# Altium schematic sheet Charge Amp.SchDoc
size A
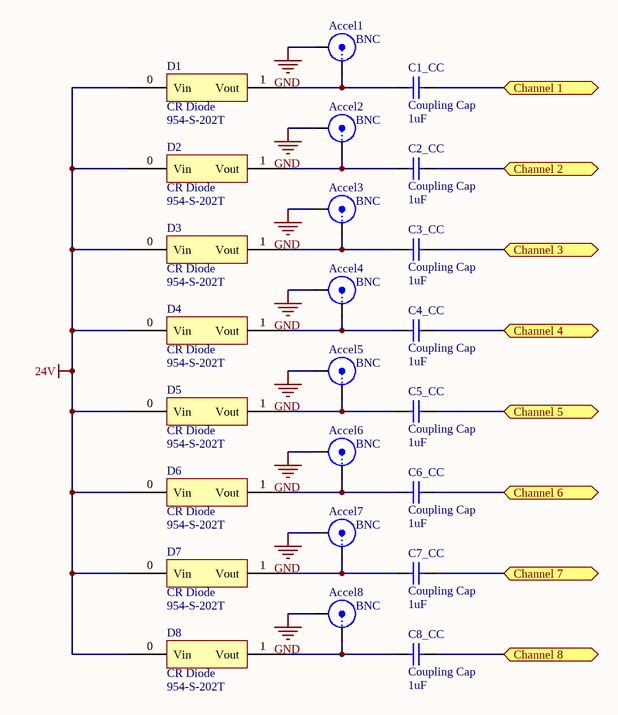
[diagram p0: Charge Amp.SchDoc]

## Parts
Accel1  BNC  [BNC_RA CON]
Accel2  BNC  [BNC_RA CON]
Accel3  BNC  [BNC_RA CON]
Accel4  BNC  [BNC_RA CON]
Accel5  BNC  [BNC_RA CON]
Accel6  BNC  [BNC_RA CON]
Accel7  BNC  [BNC_RA CON]
Accel8  BNC  [BNC_RA CON]
C1_CC  Coupling Cap  value 1uF  [C1206]
C2_CC  Coupling Cap  value 1uF  [C1206]
C3_CC  Coupling Cap  value 1uF  [C1206]
C4_CC  Coupling Cap  value 1uF  [C1206]
C5_CC  Coupling Cap  value 1uF  [C1206]
C6_CC  Coupling Cap  value 1uF  [C1206]
C7_CC  Coupling Cap  value 1uF  [C1206]
C8_CC  Coupling Cap  value 1uF  [C1206]
D1  CR Diode  Supplier Part Number 1: 954-S-202T  [CR Diode - duplicate1]
D2  CR Diode  Supplier Part Number 1: 954-S-202T  [CR Diode - duplicate1]
D3  CR Diode  Supplier Part Number 1: 954-S-202T  [CR Diode - duplicate1]
D4  CR Diode  Supplier Part Number 1: 954-S-202T  [CR Diode - duplicate1]
D5  CR Diode  Supplier Part Number 1: 954-S-202T  [CR Diode - duplicate1]
D6  CR Diode  Supplier Part Number 1: 954-S-202T  [CR Diode - duplicate1]
D7  CR Diode  Supplier Part Number 1: 954-S-202T  [CR Diode - duplicate1]
D8  CR Diode  Supplier Part Number 1: 954-S-202T  [CR Diode - duplicate1]

## Ports
Channel 1, Channel 2, Channel 3, Channel 4, Channel 5, Channel 6, Channel 7, Channel 8

## Nets
24V: D1.0(Vin) D2.0(Vin) D3.0(Vin) D4.0(Vin) D5.0(Vin) D6.0(Vin) D7.0(Vin) D8.0(Vin)
GND: Accel1.2(Y) Accel2.2(Y) Accel3.2(Y) Accel4.2(Y) Accel5.2(Y) Accel6.2(Y) Accel7.2(Y) Accel8.2(Y)
Channel 1: C1_CC.2 ; port Channel 1
Channel 2: C2_CC.2 ; port Channel 2
Channel 3: C3_CC.2 ; port Channel 3
Channel 4: C4_CC.2 ; port Channel 4
Channel 5: C5_CC.2 ; port Channel 5
Channel 6: C6_CC.2 ; port Channel 6
Channel 7: C7_CC.2 ; port Channel 7
Channel 8: C8_CC.2 ; port Channel 8
NetAccel1_1: Accel1.1(X) C1_CC.1 D1.1(Vout)
NetAccel2_1: Accel2.1(X) C2_CC.1 D2.1(Vout)
NetAccel3_1: Accel3.1(X) C3_CC.1 D3.1(Vout)
NetAccel4_1: Accel4.1(X) C4_CC.1 D4.1(Vout)
NetAccel5_1: Accel5.1(X) C5_CC.1 D5.1(Vout)
NetAccel6_1: Accel6.1(X) C6_CC.1 D6.1(Vout)
NetAccel7_1: Accel7.1(X) C7_CC.1 D7.1(Vout)
NetAccel8_1: Accel8.1(X) C8_CC.1 D8.1(Vout)

## Library data of the parts
Accel1-Accel8 = BNC: BNC Elbow Connector; LatestRevisionDate: 17-Jul-2002; LatestRevisionNote: Re-released for DXP Platform.; Publisher: Altium Limited
C1_CC C2_CC C3_CC C4_CC C5_CC C6_CC C7_CC C8_CC = Cap Semi: Capacitor (Semiconductor SIM Model); Published: 8-Jun-2000; LatestRevisionDate: 29-May-2009; LatestRevisionNote: IPC-7351 Footprint Added.; PackageReference: C1206; Publisher: Altium Limited; PackageDescription: Chip Capacitor
D1-D8 = Diode_1: Current Regulator Diodes 100V 2mA; Supplier 1: Mouser